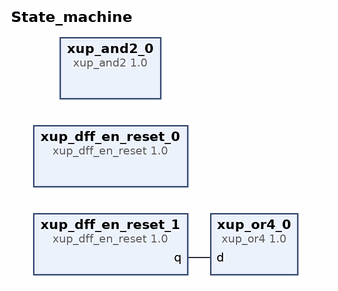
[diagram p0: block diagram of the top level]
# Vivado block design State_machine, xc7a35tcpg236-1, Vivado 2018.3
create_bd_design State_machine

create_bd_cell -type ip -vlnv xilinx.com:XUP:xup_dff_en_reset:1.0 xup_dff_en_reset_0
set_property -dict {CONFIG.DELAY 0} [get_bd_cells xup_dff_en_reset_0]
create_bd_cell -type ip -vlnv xilinx.com:XUP:xup_dff_en_reset:1.0 xup_dff_en_reset_1
set_property -dict {CONFIG.DELAY 0} [get_bd_cells xup_dff_en_reset_1]
create_bd_cell -type ip -vlnv xilinx.com:XUP:xup_or4:1.0 xup_or4_0
set_property -dict {CONFIG.DELAY 0} [get_bd_cells xup_or4_0]
create_bd_cell -type ip -vlnv xilinx.com:XUP:xup_and2:1.0 xup_and2_0
set_property -dict {CONFIG.DELAY 0} [get_bd_cells xup_and2_0]

# ---- connections ----

connect_bd_net [get_bd_pins xup_dff_en_reset_1/q] [get_bd_pins xup_or4_0/d]

validate_bd_design
save_bd_design
